# Altium project nixie_pcb.PrjPcb
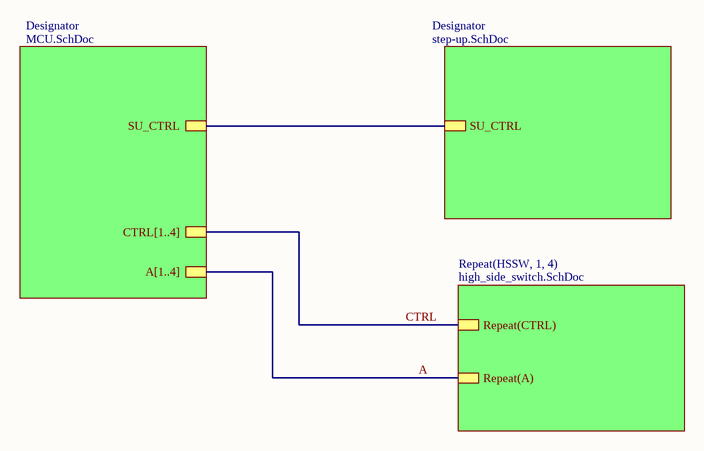
[diagram p0: TOP.SchDoc]
4 sheets, 61 parts. Net scope: hierarchical (ports join the sheet entries above them; power ports are global).
Board file: nixie_pcb.PcbDoc
Sheets:
  TOP.SchDoc
    Designator = MCU.SchDoc
    Designator = step-up.SchDoc
    HSSW1 = high_side_switch.SchDoc
    HSSW2 = high_side_switch.SchDoc
    HSSW3 = high_side_switch.SchDoc
    HSSW4 = high_side_switch.SchDoc

## Sheet TOP.SchDoc
size A4

### Sub-sheets
Designator = MCU.SchDoc: A[1..4], CTRL[1..4], SU_CTRL
Designator = step-up.SchDoc: SU_CTRL
Repeat(HSSW, 1, 4) = high_side_switch.SchDoc: Repeat(CTRL), Repeat(A)

### Nets
A: sheet Repeat(HSSW, 1, 4)/Repeat(A)
CTRL: sheet Repeat(HSSW, 1, 4)/Repeat(CTRL)
NetR5_1: sheet Designator/SU_CTRL, sheet Designator/SU_CTRL

## Sheet MCU.SchDoc
size A4
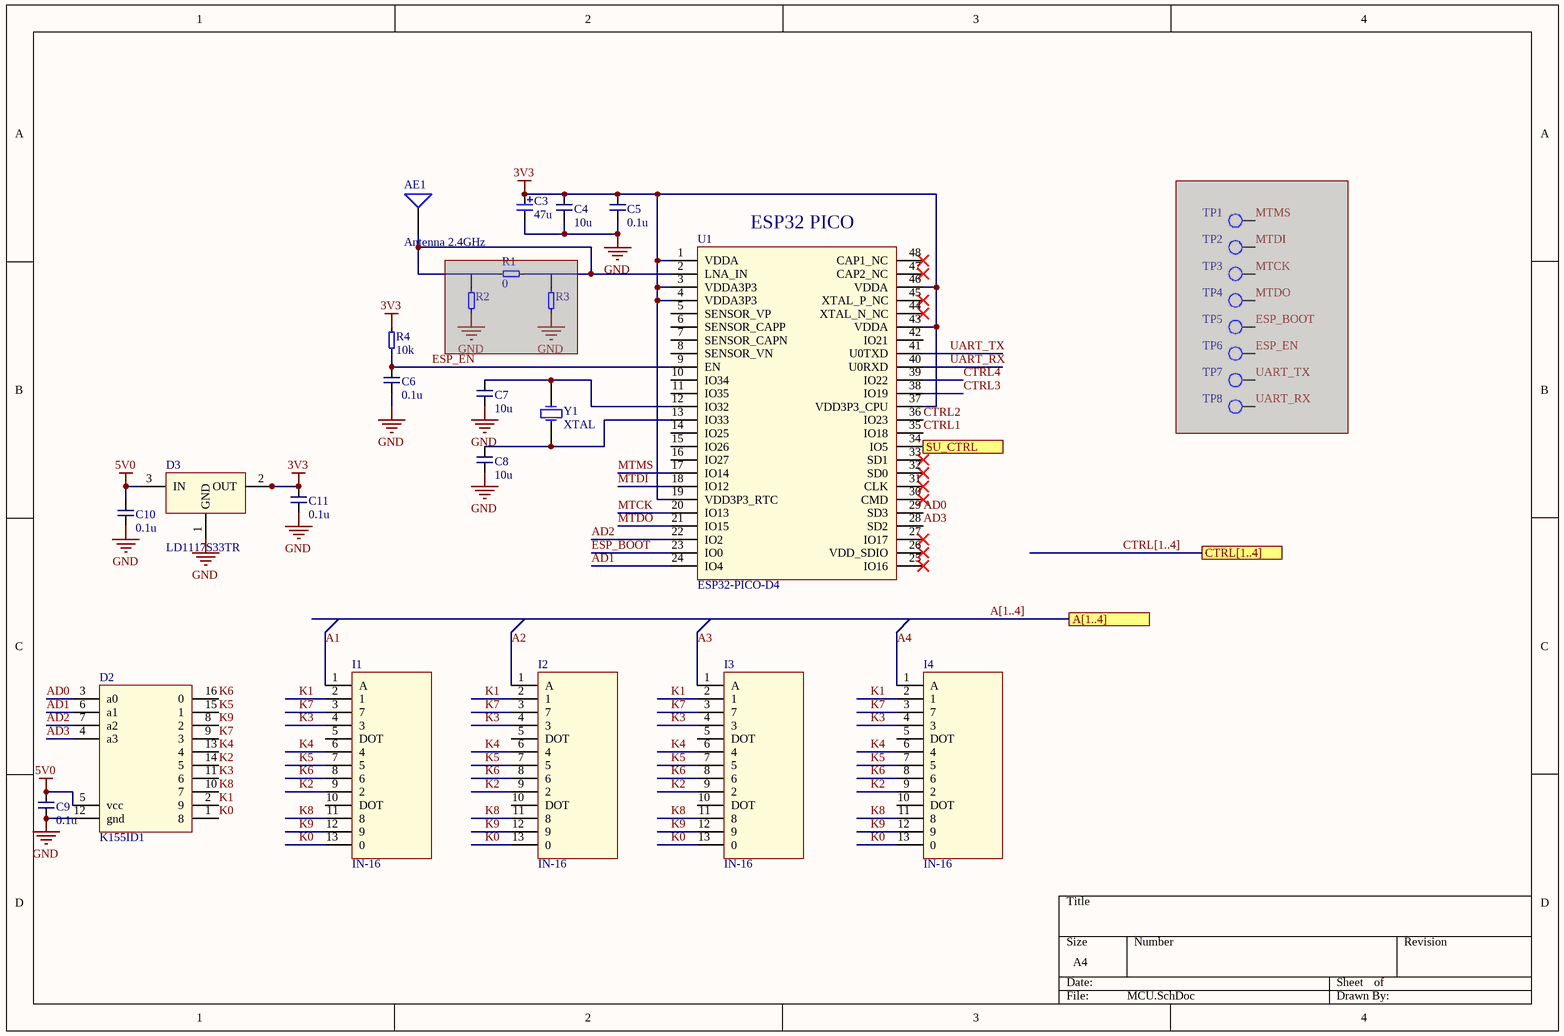
[diagram p1: MCU.SchDoc]

### Parts
AE1  Antenna 2.4GHz  [Antenna 2.4Ghz]  (no BOM)
C3  value 47u  [cap_tant_0603]  (hidden comment: F980J476MMA)
C4  value 10u  [cap 0402]
C5  value 0.1u  [cap 0402]
C6  value 0.1u  [cap 0402]
C7  value 10u  [cap 0402]
C8  value 10u  [cap 0402]
C9  value 0.1u  [cap 0402]
C10  value 0.1u  [cap 0402]
C11  value 0.1u  [cap 0402]
D2  K155ID1  [DIP16]
D3  LD1117S33TR  [SOT223_N]
I1  IN-16  [IN-16]
I2  IN-16  [IN-16]
I3  IN-16  [IN-16]
I4  IN-16  [IN-16]
R1  value 0  [res 0402]  (masked out: inside a compile mask, not in the netlist)
R2  (no value)  [res 0402]  (masked out: inside a compile mask, not in the netlist)
R3  (no value)  [res 0402]  (masked out: inside a compile mask, not in the netlist)
R4  value 10k  [res 0402]
TP1  test_point_1mm  [test_point_1mm]  (value not drawn)  (no BOM)  (masked out: inside a compile mask, not in the netlist)
TP2  test_point_1mm  [test_point_1mm]  (value not drawn)  (no BOM)  (masked out: inside a compile mask, not in the netlist)
TP3  test_point_1mm  [test_point_1mm]  (value not drawn)  (no BOM)  (masked out: inside a compile mask, not in the netlist)
TP4  test_point_1mm  [test_point_1mm]  (value not drawn)  (no BOM)  (masked out: inside a compile mask, not in the netlist)
TP5  test_point_1mm  [test_point_1mm]  (value not drawn)  (no BOM)  (masked out: inside a compile mask, not in the netlist)
TP6  test_point_1mm  [test_point_1mm]  (value not drawn)  (no BOM)  (masked out: inside a compile mask, not in the netlist)
TP7  test_point_1mm  [test_point_1mm]  (value not drawn)  (no BOM)  (masked out: inside a compile mask, not in the netlist)
TP8  test_point_1mm  [test_point_1mm]  (value not drawn)  (no BOM)  (masked out: inside a compile mask, not in the netlist)
U1  ESP32-PICO-D4  [ESP32-PICO-D4_Round_corner_pads]
Y1  XTAL  [32.768khz_quartz]

### Ports
A[1..4], CTRL[1..4], SU_CTRL

### Nets
3V3: C3.1 C4.1 C5.1 C11.1 D3.2(OUT) D3.4 R4.1 U1.1(VDDA) U1.3(VDDA3P3) U1.4(VDDA3P3) U1.19(VDD3P3_RTC) U1.37(VDD3P3_CPU) U1.43(VDDA) U1.46(VDDA)
5V0: C9.1 C10.1 D2.5(vcc) D3.3(IN)
GND: C3.2 C4.2 C5.2 C6.2 C7.2 C8.2 C9.2 C10.2 C11.2 D2.12(gnd) D3.1(GND) U1.49
A1: I1.1(A)
A2: I2.1(A)
A3: I3.1(A)
A4: I4.1(A)
AD0: D2.3(a0) U1.29(SD3)
AD1: D2.6(a1) U1.24(IO4)
AD2: D2.7(a2) U1.22(IO2)
AD3: D2.4(a3) U1.28(SD2)
CTRL1: U1.35(IO18)
CTRL2: U1.36(IO23)
CTRL3: U1.38(IO19)
CTRL4: U1.39(IO22)
ESP_BOOT: U1.23(IO0)
ESP_EN: C6.1 R4.2 U1.9(EN)
K0: D2.1(8) I1.13(0) I2.13(0) I3.13(0) I4.13(0)
K1: D2.2(9) I1.2(1) I2.2(1) I3.2(1) I4.2(1)
K2: D2.14(5) I1.9(2) I2.9(2) I3.9(2) I4.9(2)
K3: D2.11(6) I1.4(3) I2.4(3) I3.4(3) I4.4(3)
K4: D2.13(4) I1.6(4) I2.6(4) I3.6(4) I4.6(4)
K5: D2.15(1) I1.7(5) I2.7(5) I3.7(5) I4.7(5)
K6: D2.16(0) I1.8(6) I2.8(6) I3.8(6) I4.8(6)
K7: D2.9(3) I1.3(7) I2.3(7) I3.3(7) I4.3(7)
K8: D2.10(7) I1.11(8) I2.11(8) I3.11(8) I4.11(8)
K9: D2.8(2) I1.12(9) I2.12(9) I3.12(9) I4.12(9)
MTCK: U1.20(IO13)
MTDI: U1.18(IO12)
MTDO: U1.21(IO15)
MTMS: U1.17(IO14)
UART_RX: U1.40(U0RXD)
UART_TX: U1.41(U0TXD)
NetAE1_1: AE1.1 U1.2(LNA_IN)
NetC7_1: C7.1 U1.12(IO32) Y1.2(OSC2)
NetC8_1: C8.1 U1.13(IO33) Y1.1(OSC1)
NetR5_1: U1.34(IO5) ; port SU_CTRL

Not connected (* = marked no-connect by the designer): I1 5(DOT) 10(DOT); I2 5(DOT) 10(DOT); I3 5(DOT) 10(DOT); I4 5(DOT) 10(DOT); U1 5(SENSOR_VP) 6(SENSOR_CAPP) 7(SENSOR_CAPN) 8(SENSOR_VN) 10(IO34) 11(IO35) 14(IO25) 15(IO26) 16(IO27) 25(IO16)* 26(VDD_SDIO)* 27(IO17)* 30(CMD)* 31(CLK)* 32(SD0)* 33(SD1)* 42(IO21) 44(XTAL_N_NC)* 45(XTAL_P_NC)* 47(CAP2_NC)* 48(CAP1_NC)*

### Buses and harness runs
bus A[1..4] = port A[1..4]
bus CTRL[1..4] = port CTRL[1..4]

### Notes on the sheet
- (near U1) ESP32 PICO

### Library data of the parts
C3 = cap_tant: CAP TANT 47UF 20% 6.3V 0603; P/N: F980J476MMA
C4 C7 C8 = cap_small: CAP CER 10UF 6.3V X5R 0402; P/N: GRJ155R60J106ME11D
C5 C6 C9-C11 = cap_small: CAP CER 0.1UF 10V X5R 0402; P/N: CL05A104MP5NNNC
R1 = res_small: RES 0 OHM JUMPER 1/16W 0402; P/N: RMCF0402ZT0R00
R2 R3 = res_small: P/N: DNP
R4 = res_small: RES SMD 10K OHM 1% 1/16W 0402; P/N: RC0402FR-0710KL
U1 = ESP32-PICO-D4: ESP32 WIFI BLUETOOTH; P/N: ESP32-PICO-D4
Y1 = XTAL: Crystal Oscillator; Published: 8-Jun-2000; LatestRevisionDate: 17-Jul-2002; LatestRevisionNote: Re-released for DXP Platform.; PackageReference: R38; Publisher: Altium Limited; PackageDescription: Crystal, Thru-Hole; 2 Leads; Body 3.1 x 8.2 mm (Dia.xH)

## Sheet step-up.SchDoc
size A4
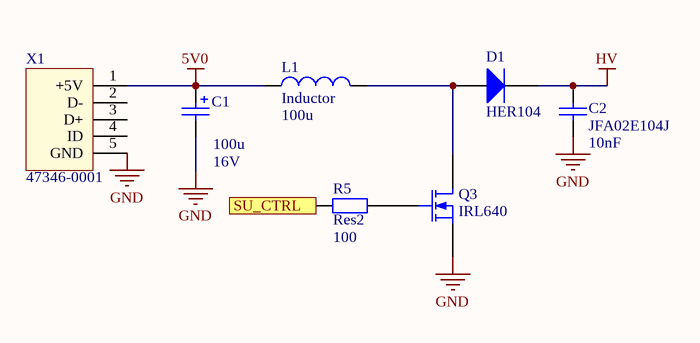
[diagram p2: step-up.SchDoc]

### Parts
C1  value 100u  Voltage: 16V  [cap_pol_5*11]  (hidden comment: Cap Pol2)
C2  JFA02E104J  value 10nF  [film_cap_10]
D1  HER104  [DO-204AL]
L1  Inductor  value 100u  [SDR0604]
Q3  IRL640  [to220_lying]
R5  Res2  value 100  [0402_res]
X1  47346-0001  [MOLEX_47346-0001]

### Ports
SU_CTRL

### Nets
5V0: C1.1 L1.1 X1.1(+5V)
GND: C1.2 C2.1 Q3.3(S) X1.5(GND)
HV: C2.2 D1.2(K)
NetD1_1: D1.1(A) L1.2 Q3.1(D)
NetQ3_2: Q3.2(G) R5.2
NetR5_1: R5.1 ; port SU_CTRL

Not connected (* = marked no-connect by the designer): X1 2(D-) 3(D+) 4(ID)

### Library data of the parts
C1 = Cap Pol2: Polarized Capacitor (Axial); Published: 8-Jun-2000; LatestRevisionDate: 17-Jul-2002; LatestRevisionNote: Re-released for DXP Platform.; PackageReference: POLAR0.8; Publisher: Altium Limited; PackageDescription: Polarized Capacitor; 2 Leads
C2 = Cap: Capacitor; Published: 8-Jun-2000; LatestRevisionDate: 17-Jul-2002; LatestRevisionNote: Re-released for DXP Platform.; PackageReference: RAD-0.3; Publisher: Altium Limited; PackageDescription: Radial Cap, Thru-Hole; 2 Leads; 0.3 in Pin Spacing
D1 = Diode: Default Diode; Published: 8-Jun-2000; LatestRevisionDate: 17-Jul-2002; LatestRevisionNote: Re-released for DXP Platform.; PackageVersion: Sep-1996; PackageReference: SMC; Publisher: Altium Limited; PackageDescription: DO-214-AB/SMC; 2 C-Bend Leads; Body 7.9 x 5.9 mm, inc. leads (LxW); Code_JEDEC: DO-214-AB
L1 = Inductor: Code_IEC: 1005; Published: 8-Jun-2000; LatestRevisionDate: 29-May-2009; LatestRevisionNote: IPC-7351 Footprint Added.; PackageReference: 0402-A; Publisher: Altium Limited; PackageDescription: Chip Inductor; Code_JEITA: 0402
Q3 = MOSFET-N: N-Channel MOSFET; pin to pad: 1>2 2>1; Published: 8-Jun-2000; LatestRevisionDate: 17-Jul-2002; LatestRevisionNote: Re-released for DXP Platform.; PackageVersion: 1995/1996; PackageReference: E3; Publisher: Altium Limited; PackageDescription: TO, Flat Index; 3 In-Line, Axial Leads; Body Dia. 4.6mm; Lead Dia. 0.5 mm (max)
R5 = Res2: Resistor; Published: 8-Jun-2000; LatestRevisionDate: 17-Jul-2002; LatestRevisionNote: Re-released for DXP Platform.; PackageReference: AXIAL-0.4; Publisher: Altium Limited; PackageDescription: Axial Device, Thru-Hole; 2 Leads; 0.4 in Pin Spacing
X1 = micro_usb

## Sheet high_side_switch.SchDoc
size A4
Used 4 times, as channels HSSW1, HSSW2, HSSW3, HSSW4. Parts and nets are listed once, with the designators drawn on the sheet.
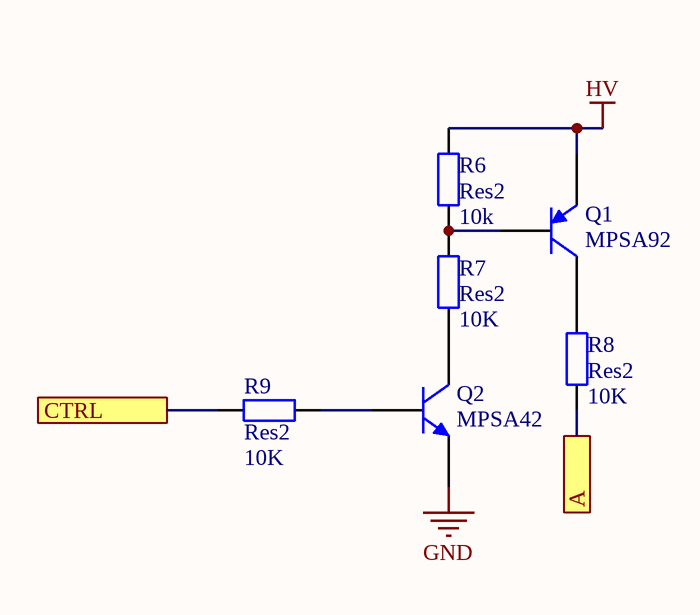
[diagram p3: high_side_switch.SchDoc]

### Parts
Q1  MPSA92  [TO-92 bent leads]
Q2  MPSA42  [TO-92 bent leads]
R6  Res2  value 10k  [0402_res]
R7  Res2  value 10K  [0402_res]
R8  Res2  value 10K  [0402_res]
R9  Res2  value 10K  [0402_res]

### Ports
A, CTRL

### Nets
GND: Q2.3(E)
HV: Q1.3(E) R6.2
A: R8.1 ; port A
CTRL: R9.2 ; port CTRL
NetQ1_1: Q1.1(C) R8.2
NetQ1_2: Q1.2(B) R6.1 R7.2
NetQ2_1: Q2.1(C) R7.1
NetQ2_2: Q2.2(B) R9.1

### Channels
HSSW1: designators end in _1; ports A=A1 CTRL=CTRL1
HSSW2: designators end in _2; ports A=A2 CTRL=CTRL2
HSSW3: designators end in _3; ports A=A3 CTRL=CTRL3
HSSW4: designators end in _4; ports A=A4 CTRL=CTRL4

### Library data of the parts
Q1 = PNP: PNP Bipolar Transistor; Published: 8-Jun-2000; LatestRevisionDate: 29-May-2009; LatestRevisionNote: IPC-7351 Footprint Added.; PackageVersion: Aug-1999; PackageReference: SOT-23B; Publisher: Altium Limited; PackageDescription: 3-Pin SOT-23 Package 0.95 mm Pitch, 2.4 mm Lead Span
Q2 = NPN: NPN Bipolar Transistor; Published: 8-Jun-2000; LatestRevisionDate: 17-Jul-2002; LatestRevisionNote: Re-released for DXP Platform.; PackageReference: TO-226-AA; Publisher: Altium Limited; PackageDescription: TO, Flat Index; 3 In-Line, Axial Leads; Body Dia. 4.8mm; Leads 0.55 x 0.51 mm (max); Code_JEDEC: TO-226-AA
R6-R9 = Res2: Resistor; Published: 8-Jun-2000; LatestRevisionDate: 17-Jul-2002; LatestRevisionNote: Re-released for DXP Platform.; PackageReference: AXIAL-0.4; Publisher: Altium Limited; PackageDescription: Axial Device, Thru-Hole; 2 Leads; 0.4 in Pin Spacing

## Nets that join several sheets
5V0: MCU (C9.1 C10.1 D2.5 D3.3), step-up (C1.1 L1.1 X1.1)
GND: MCU (12 pins), step-up (C1.2 C2.1 Q3.3 X1.5), HSSW1 (Q2_1.3), HSSW2 (Q2_2.3), HSSW3 (Q2_3.3), HSSW4 (Q2_4.3)
HV: step-up (C2.2 D1.2), HSSW1 (Q1_1.3 R6_1.2), HSSW2 (Q1_2.3 R6_2.2), HSSW3 (Q1_3.3 R6_3.2), HSSW4 (Q1_4.3 R6_4.2)
NetR5_1: MCU (U1.34), step-up (R5.1)